# EAGLE design lights (EAGLE 5.11)
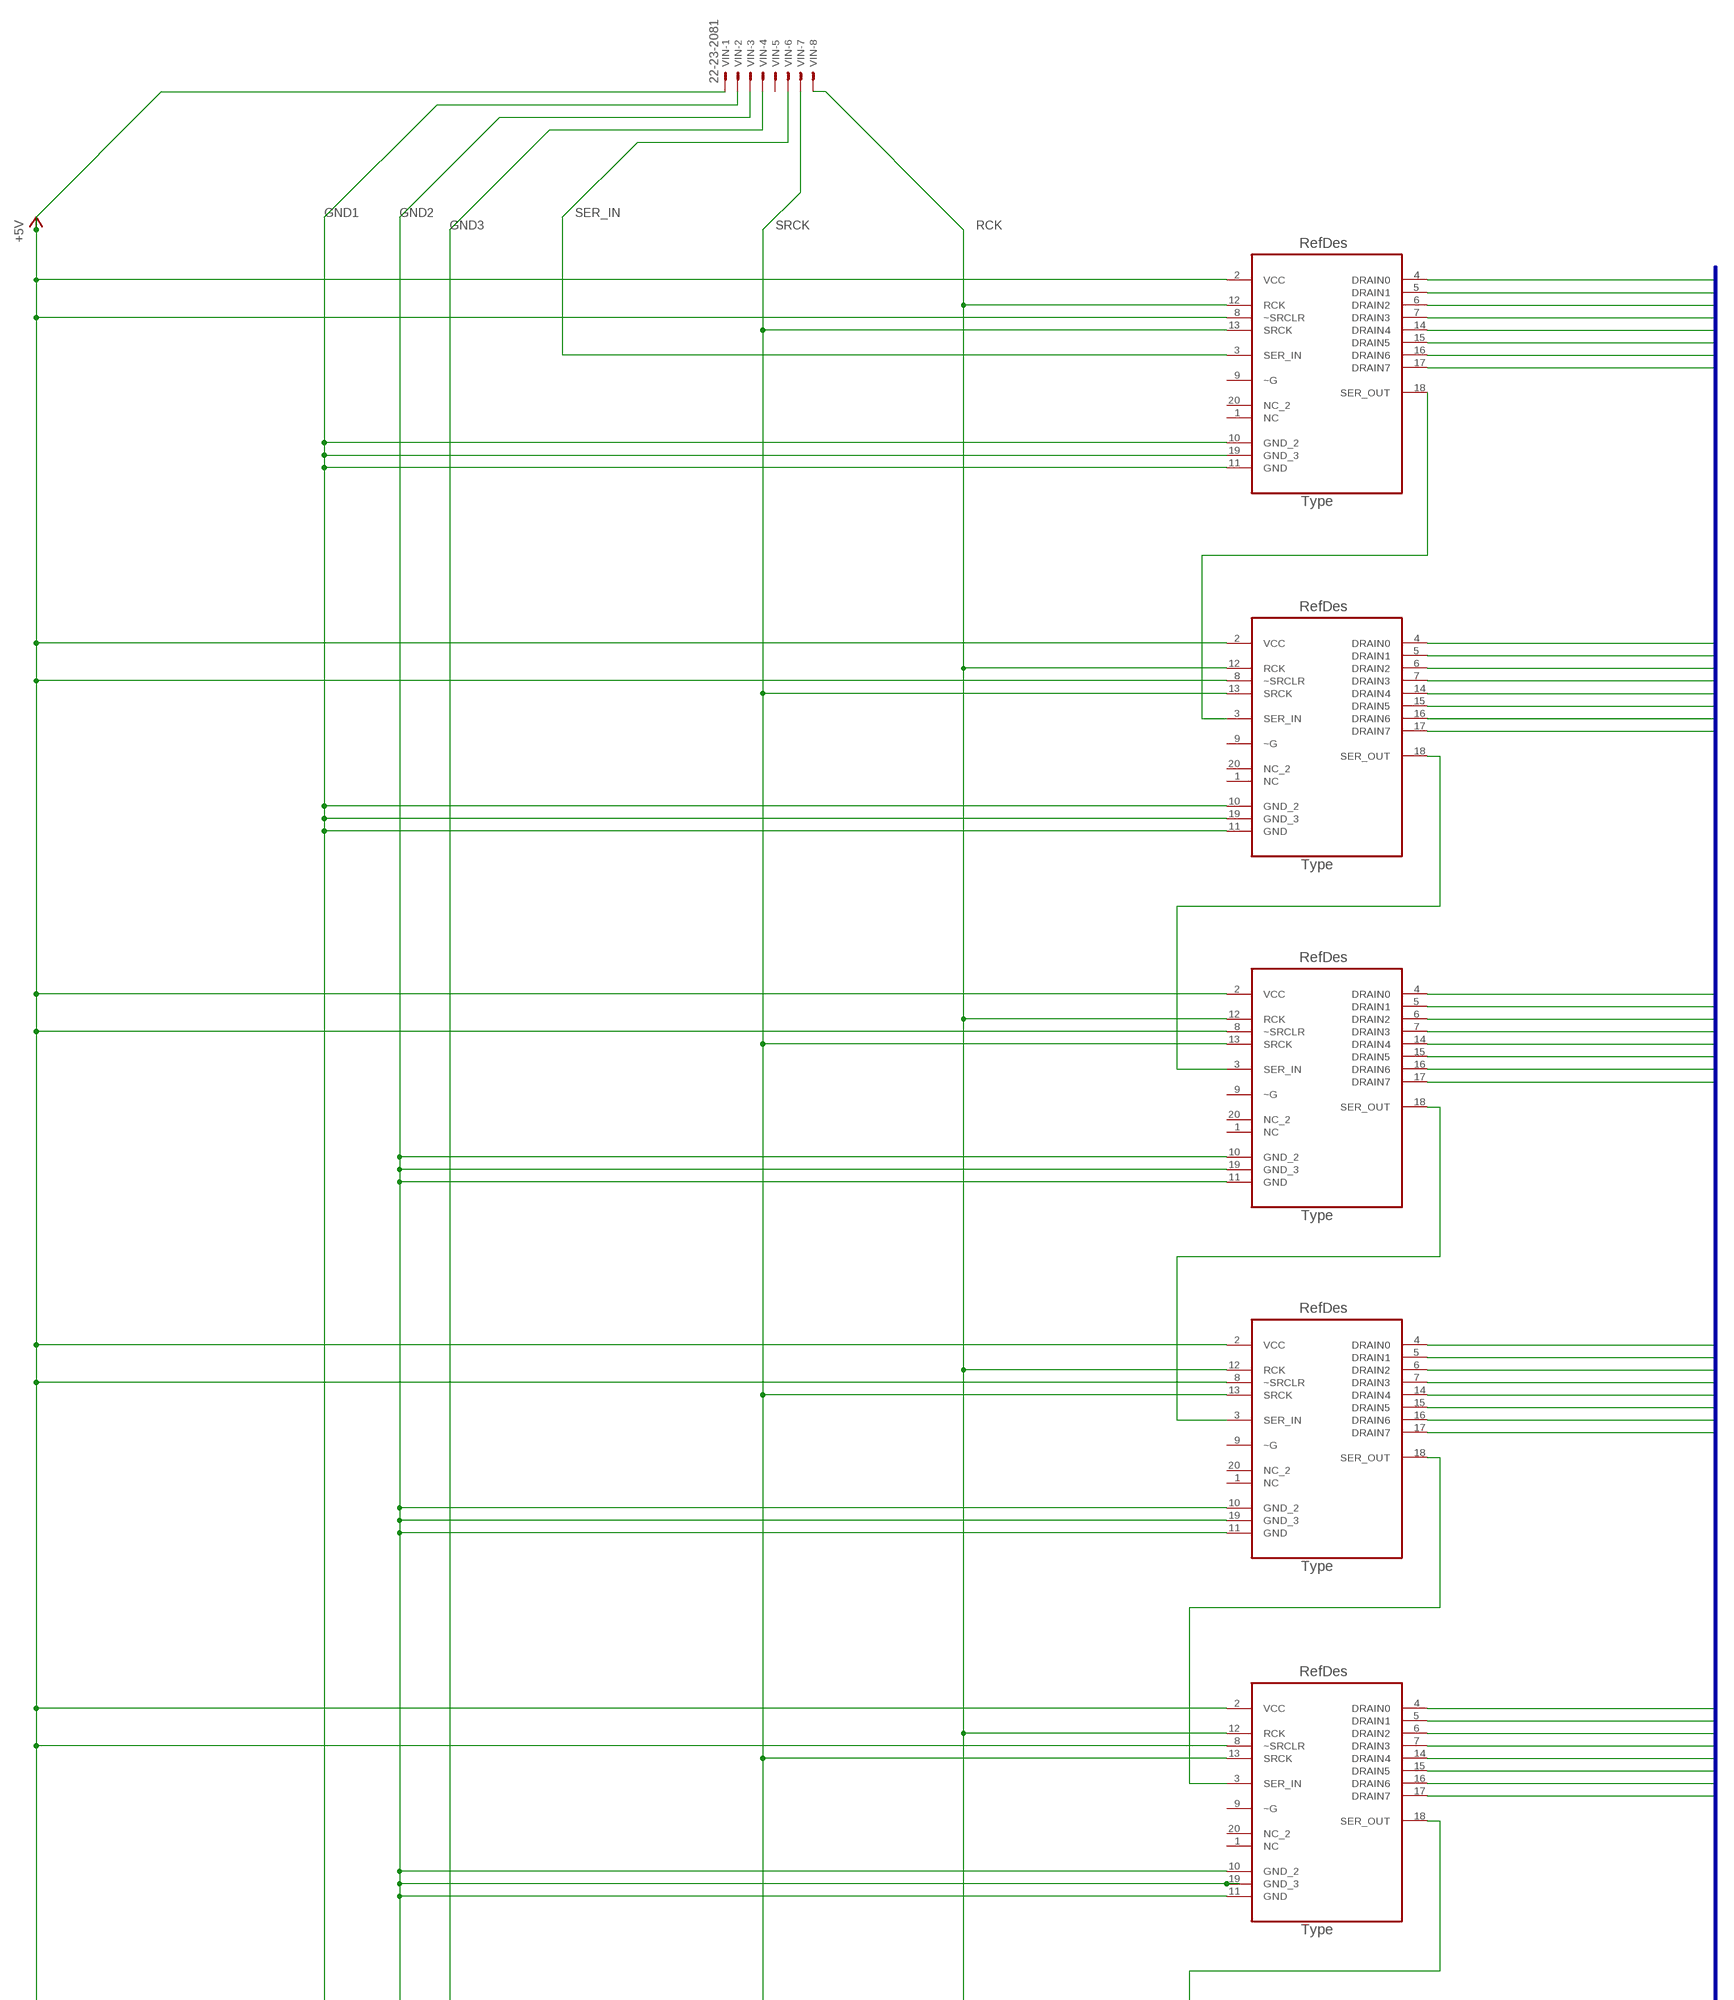
[diagram p0: schematic, sheet 1, part 1 of 3]
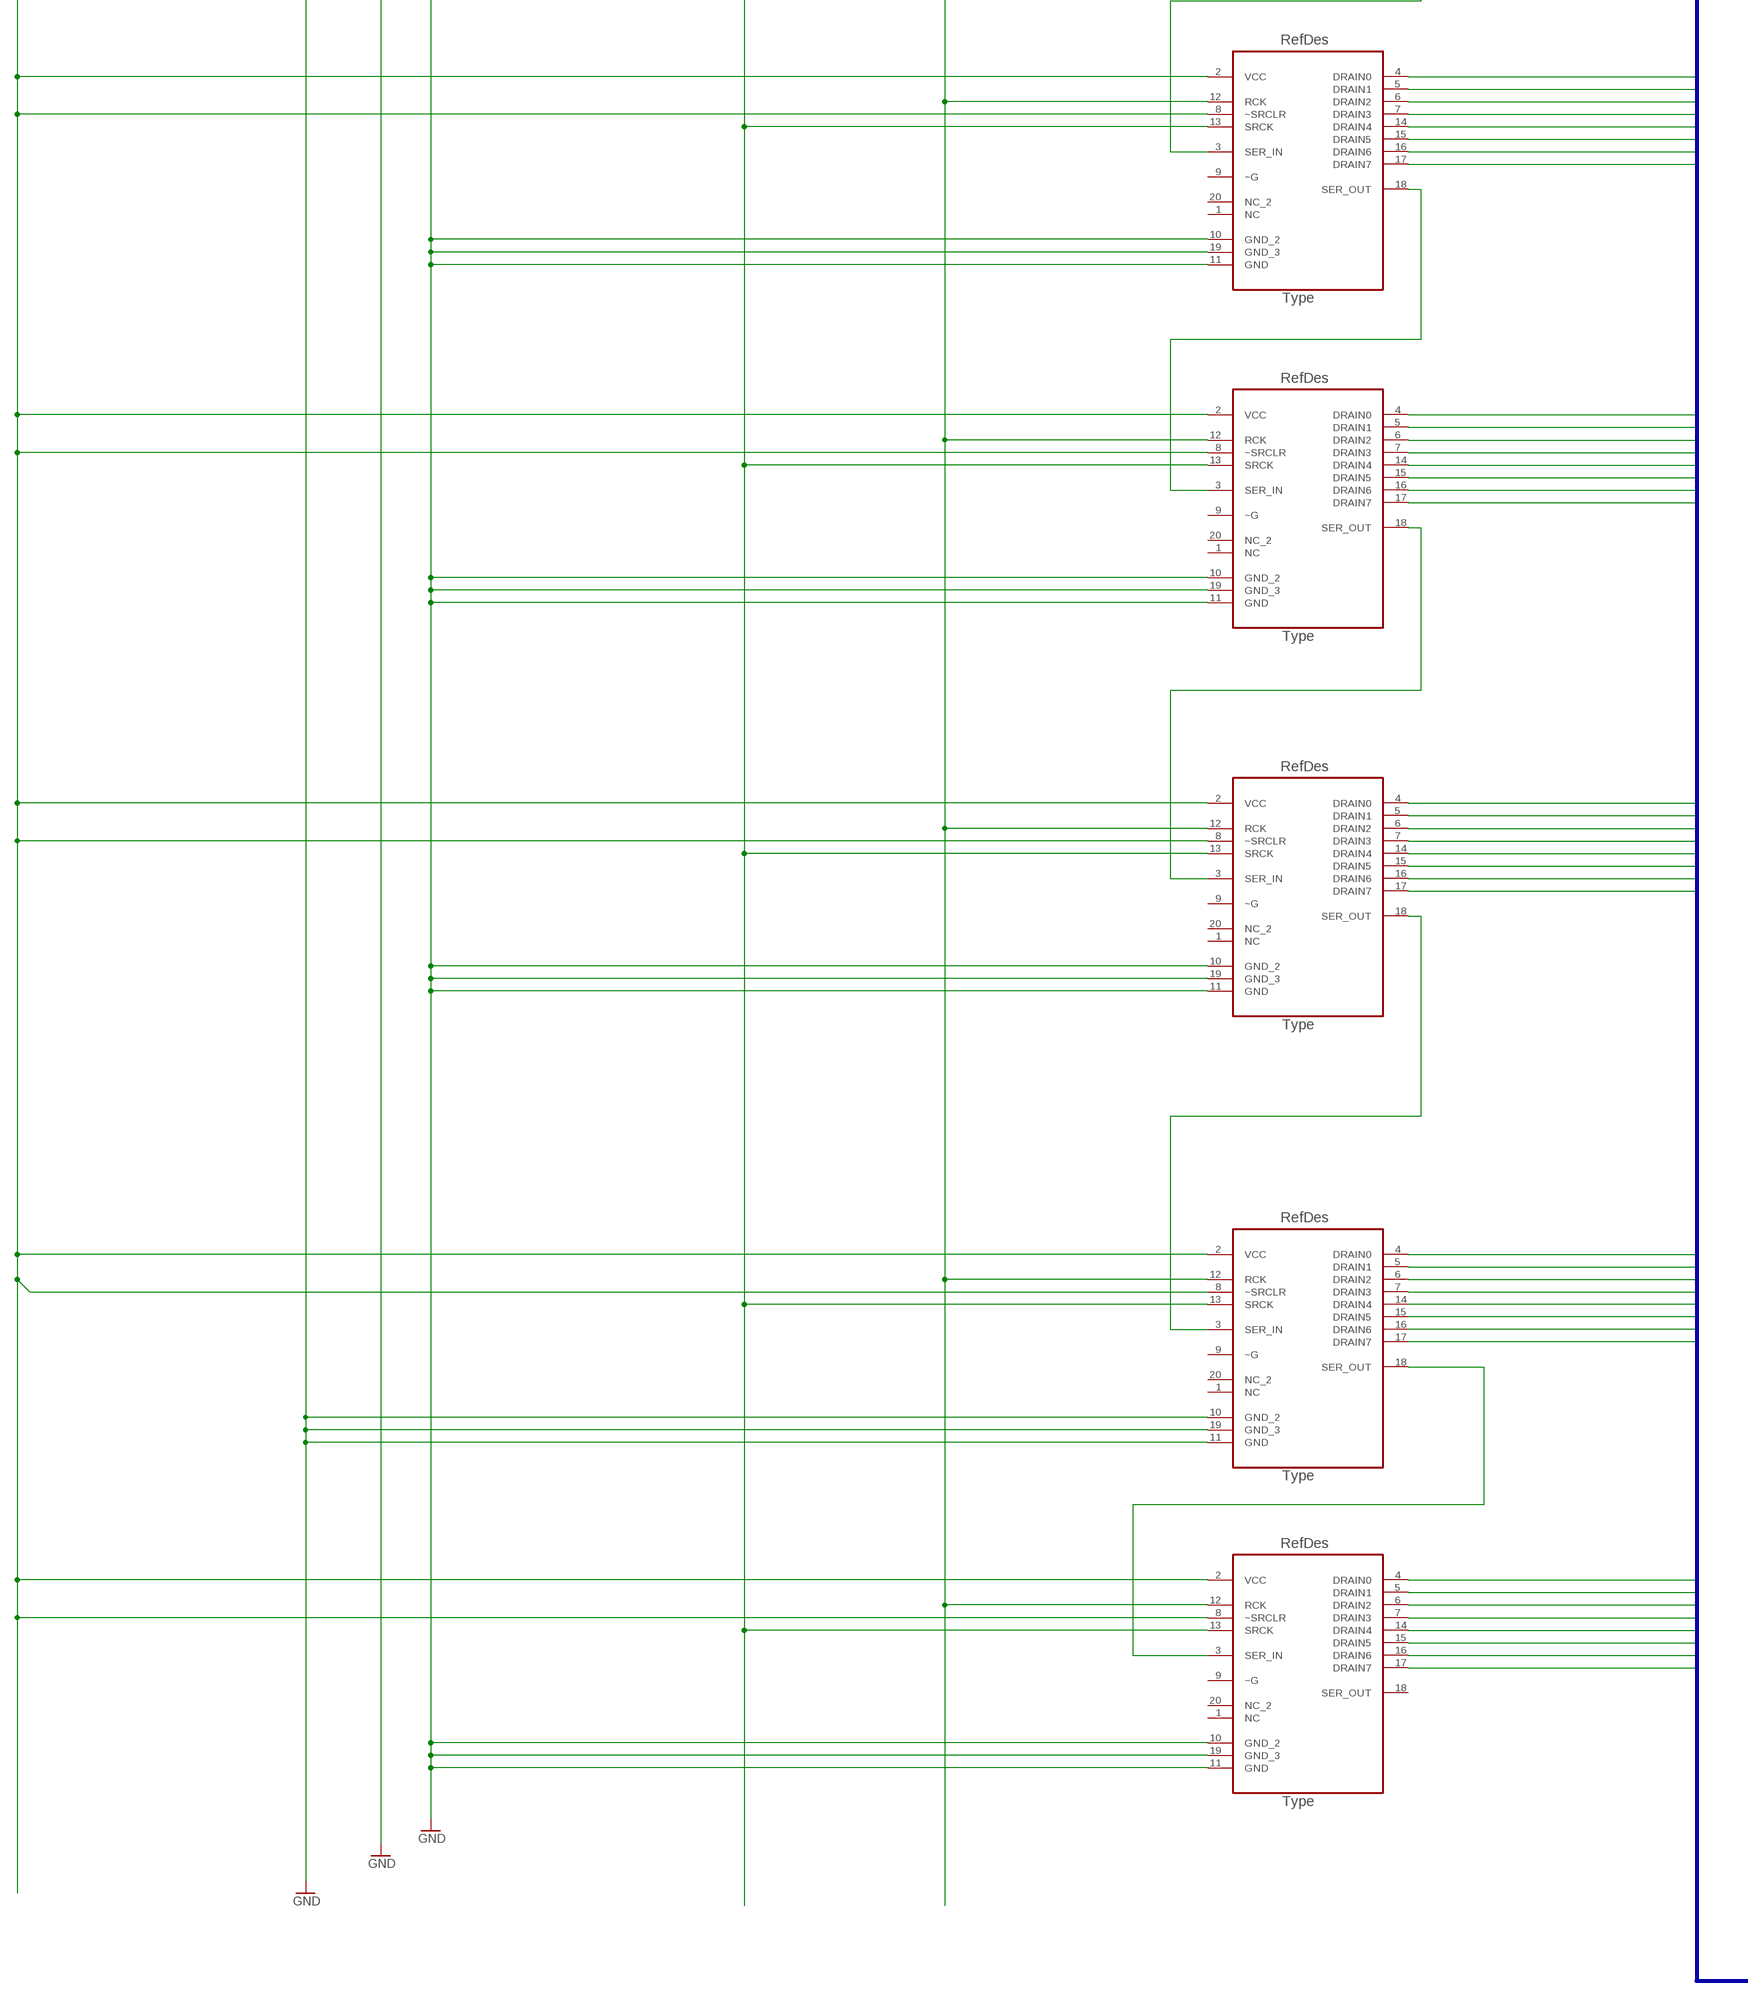
[diagram p1: schematic, sheet 1, part 2 of 3]
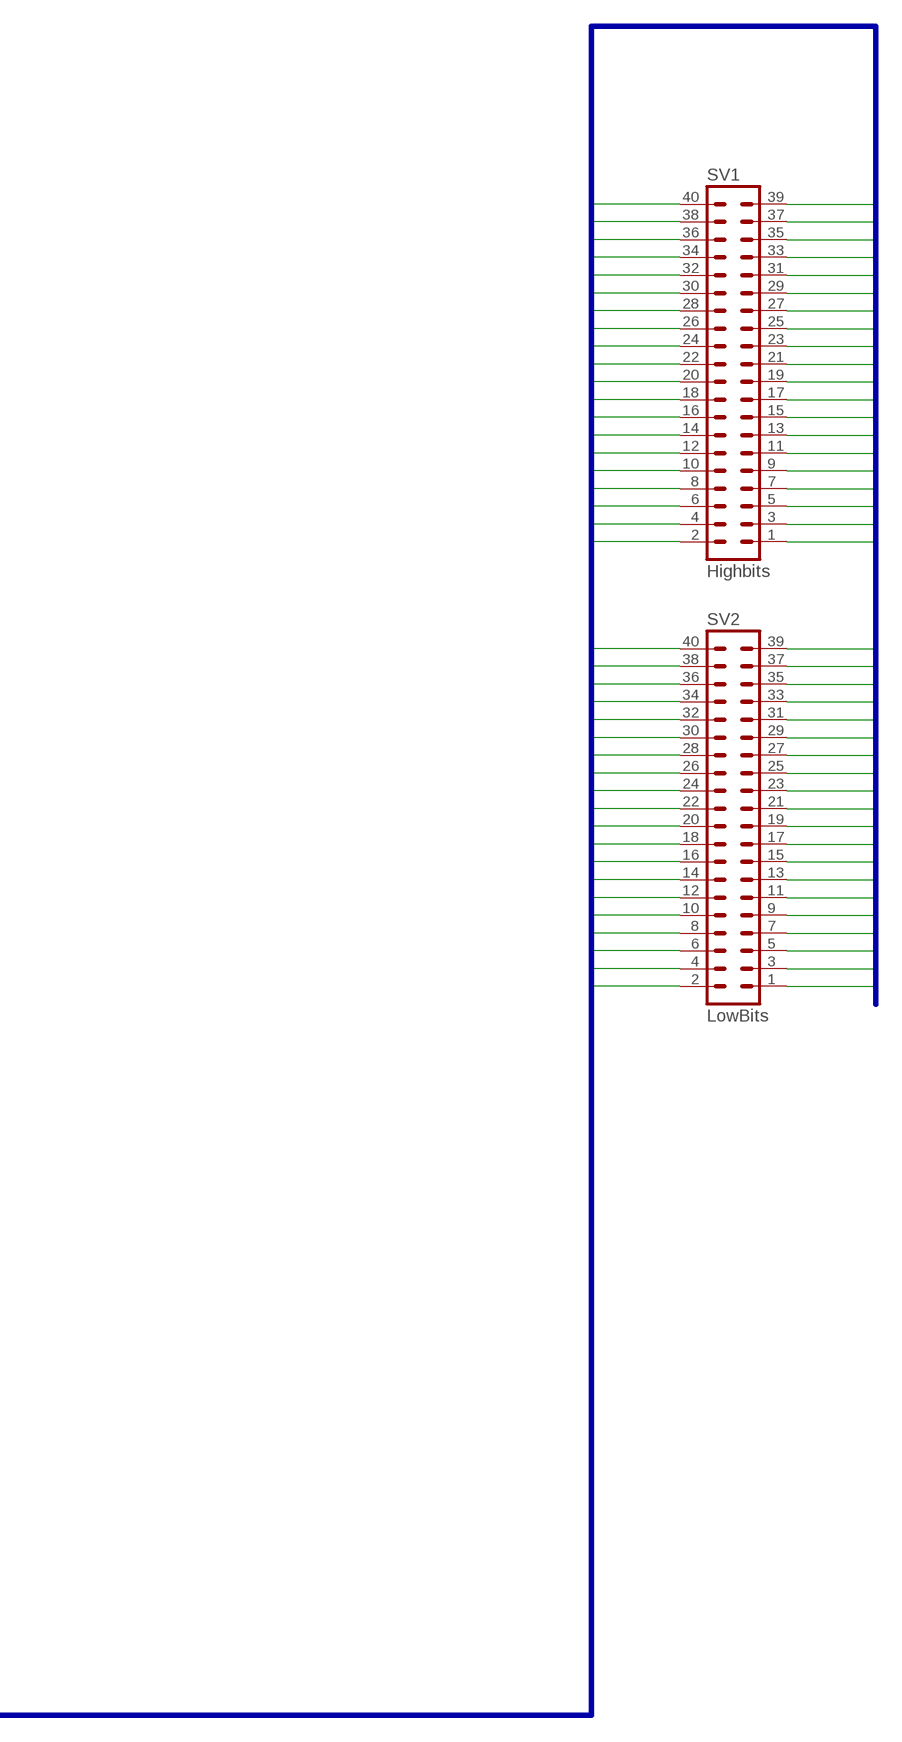
[diagram p2: schematic, sheet 1, part 3 of 3]

## Parts
SR1  TPIC6B595N  [DIP254P762X508-20]
SR2  TPIC6B595N  [DIP254P762X508-20]
SR3  TPIC6B595N  [DIP254P762X508-20]
SR4  TPIC6B595N  [DIP254P762X508-20]
SR5  TPIC6B595N  [DIP254P762X508-20]
SR6  TPIC6B595N  [DIP254P762X508-20]
SR7  TPIC6B595N  [DIP254P762X508-20]
SR8  TPIC6B595N  [DIP254P762X508-20]
SR9  TPIC6B595N  [DIP254P762X508-20]
SR10  TPIC6B595N  [DIP254P762X508-20]
SV1  Highbits  MA20-2  [MA20-2]
SV2  LowBits  MA20-2  [MA20-2]
VIN  22-23-2081  [22-23-2081]

## Nets
+5V: SR1.2(VCC) SR1.8(~SRCLR) SR2.2(VCC) SR2.8(~SRCLR) SR3.2(VCC) SR3.8(~SRCLR) SR4.2(VCC) SR4.8(~SRCLR) SR5.2(VCC) SR5.8(~SRCLR) SR6.2(VCC) SR6.8(~SRCLR) SR7.2(VCC) SR7.8(~SRCLR) SR8.2(VCC) SR8.8(~SRCLR) SR9.2(VCC) SR9.8(~SRCLR) SR10.2(VCC) SR10.8(~SRCLR) VIN.1
GND1: SR1.10(GND_2) SR1.11(GND) SR1.19(GND_3) SR2.10(GND_2) SR2.11(GND) SR2.19(GND_3) SR9.10(GND_2) SR9.11(GND) SR9.19(GND_3) VIN.2 ; supply symbol labelled GND
GND2: SR3.10(GND_2) SR3.11(GND) SR3.19(GND_3) SR4.10(GND_2) SR4.11(GND) SR4.19(GND_3) SR5.10(GND_2) SR5.11(GND) SR5.19(GND_3) VIN.3 ; supply symbol labelled GND
GND3: SR6.10(GND_2) SR6.11(GND) SR6.19(GND_3) SR7.10(GND_2) SR7.11(GND) SR7.19(GND_3) SR8.10(GND_2) SR8.11(GND) SR8.19(GND_3) SR10.10(GND_2) SR10.11(GND) SR10.19(GND_3) VIN.4 ; supply symbol labelled GND
LIGHTBIT1: SR10.17(DRAIN7) SV2.1
LIGHTBIT2: SR10.16(DRAIN6) SV2.2
LIGHTBIT3: SR10.15(DRAIN5) SV2.3
LIGHTBIT4: SR10.14(DRAIN4) SV2.4
LIGHTBIT5: SR10.7(DRAIN3) SV2.5
LIGHTBIT6: SR10.6(DRAIN2) SV2.6
LIGHTBIT7: SR10.5(DRAIN1) SV2.7
LIGHTBIT8: SR10.4(DRAIN0) SV2.8
LIGHTBIT9: SR9.17(DRAIN7) SV2.9
LIGHTBIT10: SR9.16(DRAIN6) SV2.10
LIGHTBIT11: SR9.15(DRAIN5) SV2.11
LIGHTBIT12: SR9.14(DRAIN4) SV2.12
LIGHTBIT13: SR9.7(DRAIN3) SV2.13
LIGHTBIT14: SR9.6(DRAIN2) SV2.14
LIGHTBIT15: SR9.5(DRAIN1) SV2.15
LIGHTBIT16: SR9.4(DRAIN0) SV2.16
LIGHTBIT17: SR8.17(DRAIN7) SV2.17
LIGHTBIT18: SR8.16(DRAIN6) SV2.18
LIGHTBIT19: SR8.15(DRAIN5) SV2.19
LIGHTBIT20: SR8.14(DRAIN4) SV2.20
LIGHTBIT21: SR8.7(DRAIN3) SV2.21
LIGHTBIT22: SR8.6(DRAIN2) SV2.22
LIGHTBIT23: SR8.5(DRAIN1) SV2.23
LIGHTBIT24: SR8.4(DRAIN0) SV2.24
LIGHTBIT25: SR7.17(DRAIN7) SV2.25
LIGHTBIT26: SR7.16(DRAIN6) SV2.26
LIGHTBIT27: SR7.15(DRAIN5) SV2.27
LIGHTBIT28: SR7.14(DRAIN4) SV2.28
LIGHTBIT29: SR7.7(DRAIN3) SV2.29
LIGHTBIT30: SR7.6(DRAIN2) SV2.30
LIGHTBIT31: SR7.5(DRAIN1) SV2.31
LIGHTBIT32: SR7.4(DRAIN0) SV2.32
LIGHTBIT33: SR6.17(DRAIN7) SV2.33
LIGHTBIT34: SR6.16(DRAIN6) SV2.34
LIGHTBIT35: SR6.15(DRAIN5) SV2.35
LIGHTBIT36: SR6.14(DRAIN4) SV2.36
LIGHTBIT37: SR6.7(DRAIN3) SV2.37
LIGHTBIT38: SR6.6(DRAIN2) SV2.38
LIGHTBIT39: SR6.5(DRAIN1) SV2.39
LIGHTBIT40: SR6.4(DRAIN0) SV2.40
LIGHTBIT41: SR5.17(DRAIN7) SV1.1
LIGHTBIT42: SR5.16(DRAIN6) SV1.2
LIGHTBIT43: SR5.15(DRAIN5) SV1.3
LIGHTBIT44: SR5.14(DRAIN4) SV1.4
LIGHTBIT45: SR5.7(DRAIN3) SV1.5
LIGHTBIT46: SR5.6(DRAIN2) SV1.6
LIGHTBIT47: SR5.5(DRAIN1) SV1.7
LIGHTBIT48: SR5.4(DRAIN0) SV1.8
LIGHTBIT49: SR4.17(DRAIN7) SV1.9
LIGHTBIT50: SR4.16(DRAIN6) SV1.10
LIGHTBIT51: SR4.15(DRAIN5) SV1.11
LIGHTBIT52: SR4.14(DRAIN4) SV1.12
LIGHTBIT53: SR4.7(DRAIN3) SV1.13
LIGHTBIT54: SR4.6(DRAIN2) SV1.14
LIGHTBIT55: SR4.5(DRAIN1) SV1.15
LIGHTBIT56: SR4.4(DRAIN0) SV1.16
LIGHTBIT57: SR3.17(DRAIN7) SV1.17
LIGHTBIT58: SR3.16(DRAIN6) SV1.18
LIGHTBIT59: SR3.15(DRAIN5) SV1.19
LIGHTBIT60: SR3.14(DRAIN4) SV1.20
LIGHTBIT61: SR3.7(DRAIN3) SV1.21
LIGHTBIT62: SR3.6(DRAIN2) SV1.22
LIGHTBIT63: SR3.5(DRAIN1) SV1.23
LIGHTBIT64: SR3.4(DRAIN0) SV1.24
LIGHTBIT65: SR2.17(DRAIN7) SV1.25
LIGHTBIT66: SR2.16(DRAIN6) SV1.26
LIGHTBIT67: SR2.15(DRAIN5) SV1.27
LIGHTBIT68: SR2.14(DRAIN4) SV1.28
LIGHTBIT69: SR2.7(DRAIN3) SV1.29
LIGHTBIT70: SR2.6(DRAIN2) SV1.30
LIGHTBIT71: SR2.5(DRAIN1) SV1.31
LIGHTBIT72: SR2.4(DRAIN0) SV1.32
LIGHTBIT73: SR1.17(DRAIN7) SV1.33
LIGHTBIT74: SR1.16(DRAIN6) SV1.34
LIGHTBIT75: SR1.15(DRAIN5) SV1.35
LIGHTBIT76: SR1.14(DRAIN4) SV1.36
LIGHTBIT77: SR1.7(DRAIN3) SV1.37
LIGHTBIT78: SR1.6(DRAIN2) SV1.38
LIGHTBIT79: SR1.5(DRAIN1) SV1.39
LIGHTBIT80: SR1.4(DRAIN0) SV1.40
N$4: SR9.18(SER_OUT) SR10.3(SER_IN)
N$9: SR1.18(SER_OUT) SR2.3(SER_IN)
N$18: SR2.18(SER_OUT) SR3.3(SER_IN)
N$27: SR3.18(SER_OUT) SR4.3(SER_IN)
N$36: SR4.18(SER_OUT) SR5.3(SER_IN)
N$45: SR5.18(SER_OUT) SR6.3(SER_IN)
N$62: SR7.18(SER_OUT) SR8.3(SER_IN)
N$71: SR8.18(SER_OUT) SR9.3(SER_IN)
N$80: SR6.18(SER_OUT) SR7.3(SER_IN)
RCK: SR1.12(RCK) SR2.12(RCK) SR3.12(RCK) SR4.12(RCK) SR5.12(RCK) SR6.12(RCK) SR7.12(RCK) SR8.12(RCK) SR9.12(RCK) SR10.12(RCK) VIN.8
SER_IN: SR1.3(SER_IN) VIN.6
SRCK: SR1.13(SRCK) SR2.13(SRCK) SR3.13(SRCK) SR4.13(SRCK) SR5.13(SRCK) SR6.13(SRCK) SR7.13(SRCK) SR8.13(SRCK) SR9.13(SRCK) SR10.13(SRCK) VIN.7
Unconnected: SR1.1(NC) SR1.9(~G) SR1.20(NC_2) SR2.1(NC) SR2.9(~G) SR2.20(NC_2) SR3.1(NC) SR3.9(~G) SR3.20(NC_2) SR4.1(NC) SR4.9(~G) SR4.20(NC_2) SR5.1(NC) SR5.9(~G) SR5.20(NC_2) SR6.1(NC) SR6.9(~G) SR6.20(NC_2) SR7.1(NC) SR7.9(~G) SR7.20(NC_2) SR8.1(NC) SR8.9(~G) SR8.20(NC_2) SR9.1(NC) SR9.9(~G) SR9.20(NC_2) SR10.1(NC) SR10.9(~G) SR10.18(SER_OUT) SR10.20(NC_2) VIN.5

## Buses
LIGHTBIT[1..80]

## Library data of the parts
SR1-SR10 = tpic68595N:TPIC6B595N: POWER LOGIC 8-BIT SHIFT REGISTER; DESCRIPTION: POWER LOGIC 8-BIT SHIFT REGISTER; MPN: TPIC6B595N; OC_FARNELL: 1287675; OC_NEWARK: 15M1973; PACKAGE: PDIP-20; SUPPLIER: Texas Instruments
SV1 SV2 = con-lstb:MA20-2: PIN HEADER; OC_FARNELL: unknown; OC_NEWARK: unknown
VIN = con-molex:22-23-2081: .100" (2.54mm) Center Header - 8 Pin; MF: MOLEX; MPN: 22-23-2081; OC_FARNELL: 1756826; OC_NEWARK: 01C7592

## Board
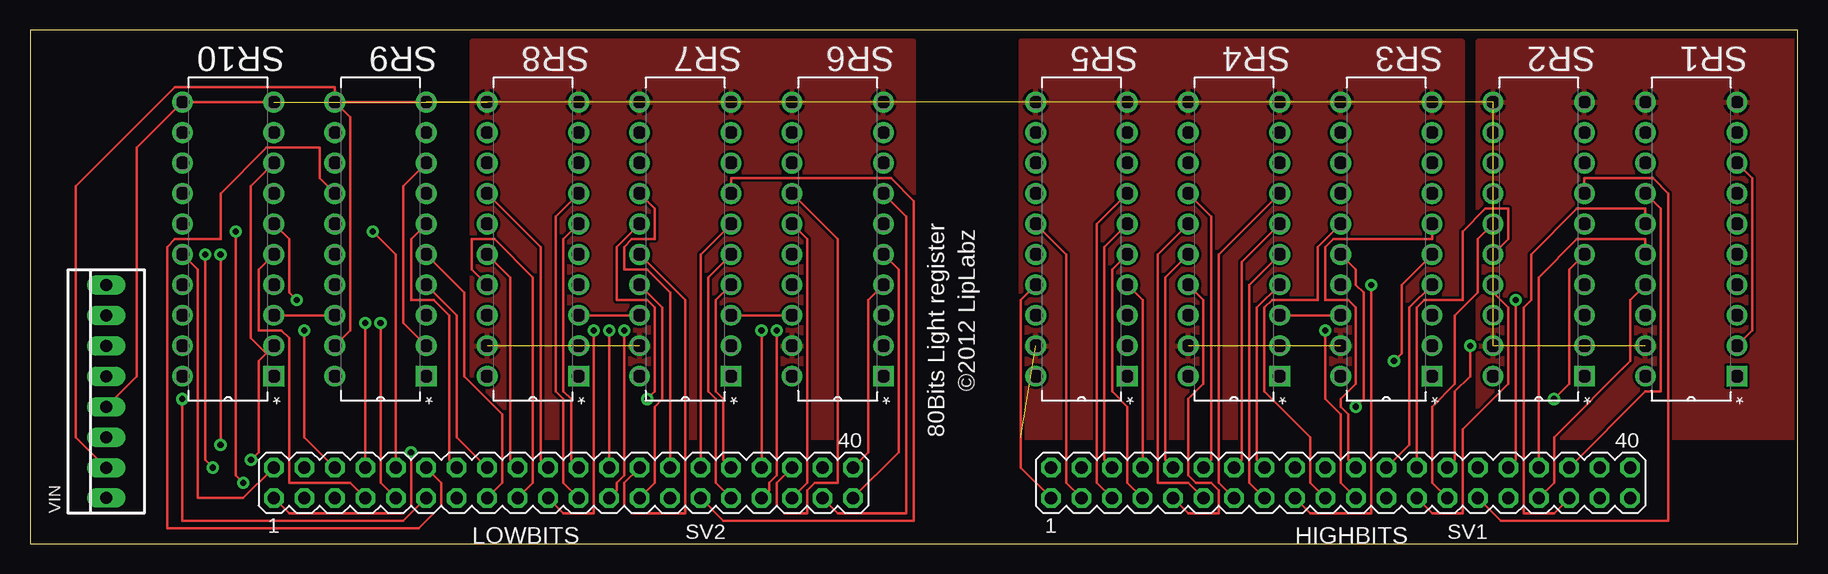
[diagram p3: board, top side]
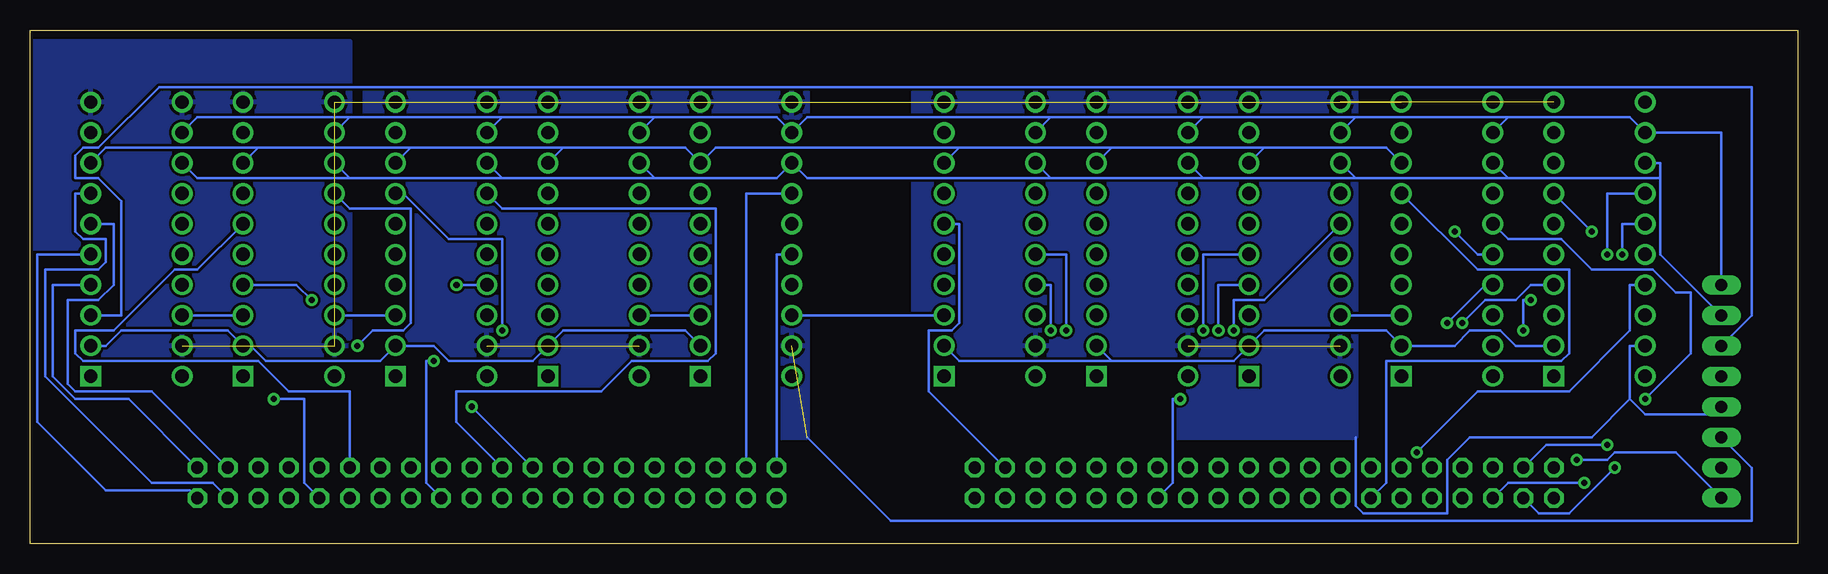
[diagram p4: board, bottom side, seen from below]

Size 147.3 x 42.85 mm. Coordinates in mm from the lower left corner, seen from the top.
Outline: 0,0 147.3,0 147.3,42.85 0,42.85 0,0
Copper layers (1*16): Top 0.035mm / dielectric 1.5mm / Bottom 0.035mm
Design rules "SparkFun": minimum track width 8mil, minimum drill 20mil, track to track 8mil, track to pad 8mil, pad to pad 8mil, via to via 8mil, smd to smd 8mil, copper to edge 10mil, drill to drill 8mil, minimum pad ring 12mil, minimum via ring 10mil, stop-mask expansion 4mil, vias tented up to drill 25mil, thermal gap 10mil

### Footprints (pad centres in the part's own frame; a part is rotated, then mirrored left to right if it is on the bottom)
DIP254P762X508-20 = drill 1.118 square: 1 -7.62,22.86 | drill 1.118 round: 2 -7.62,20.32; 3 -7.62,17.78; 4 -7.62,15.24; 5 -7.62,12.7; 6 -7.62,10.16; 7 -7.62,7.62; 8 -7.62,5.08; 9 -7.62,2.54; 10 -7.62,0; 11 0,0; 12 0,2.54; 13 0,5.08; 14 0,7.62; 15 0,10.16; 16 0,12.7; 17 0,15.24; 18 0,17.78; 19 0,20.32; 20 0,22.86
MA20-2 = drill 1.016 octagon: 1 -24.13,-1.27; 2 -24.13,1.27; 3 -21.59,-1.27; 4 -21.59,1.27; 5 -19.05,-1.27; 6 -19.05,1.27; 7 -16.51,-1.27; 8 -16.51,1.27; 9 -13.97,-1.27; 10 -13.97,1.27; 11 -11.43,-1.27; 12 -11.43,1.27; 13 -8.89,-1.27; 14 -8.89,1.27; 15 -6.35,-1.27; 16 -6.35,1.27; 17 -3.81,-1.27; 18 -3.81,1.27; 19 -1.27,-1.27; 20 -1.27,1.27; 21 1.27,-1.27; 22 1.27,1.27; 23 3.81,-1.27; 24 3.81,1.27; 25 6.35,-1.27; 26 6.35,1.27; 27 8.89,-1.27; 28 8.89,1.27; 29 11.43,-1.27; 30 11.43,1.27; 31 13.97,-1.27; 32 13.97,1.27; 33 16.51,-1.27; 34 16.51,1.27; 35 19.05,-1.27; 36 19.05,1.27; 37 21.59,-1.27; 38 21.59,1.27; 39 24.13,-1.27; 40 24.13,1.27
22-23-2081 = drill 1 long: 1 -8.89,0; 2 -6.35,0; 3 -3.81,0; 4 -1.27,0; 5 1.27,0; 6 3.81,0; 7 6.35,0; 8 8.89,0

### Placement (x,y rotation side)
SR1  134.62,36.83 180 top
SR2  121.92,36.83 180 top
SR3  109.22,36.83 180 top
SR4  96.52,36.83 180 top
SR5  83.82,36.83 180 top
SR6  63.5,36.83 180 top
SR7  50.8,36.83 180 top
SR8  38.1,36.83 180 top
SR9  25.4,36.83 180 top
SR10  12.7,36.83 180 top
SV1  109.22,5.08 0 top
SV2  44.45,5.08 0 top
VIN  6.35,12.7 90 top

### Tracks (layer width: path | path; a pad name or v marks a point on that pad's centre or on a via)
+5V  (via drill 0.51)
  Top 0.203: SR1.2 143.51,17.78 143.51,30.48 SR1.8 | v18.41,6.99 19.05,7.62 19.05,15.24 19.68,15.88 | 19.68,15.88 SR10.2 | SR10.8 18.41,29.84 18.41,17.14 19.68,15.88 | SR9.2 31.11,18.41 31.11,29.84 SR9.8
  Bottom 0.203: SR5.2 92.71,17.78 102.87,17.78 SR4.2 105.41,15.24 112.39,15.24 113.67,16.51 SR3.2 118.11,15.24 127.64,15.24 128.91,16.51 SR2.2 130.81,17.78 139.7,17.78 140.97,16.51 SR1.2 | 102.87,33.02 92.71,33.02 SR5.8 90.17,33.02 69.85,33.02 | 102.87,33.02 SR4.8 | 115.57,33.02 SR3.8 | 102.87,33.02 115.57,33.02 | 128.27,33.02 SR2.8 | 115.57,33.02 128.27,33.02 | SR1.8 140.97,33.02 128.27,33.02 | VIN.1 10.16,7.62 15.24,7.62 15.88,6.99 v18.41,6.99 | 57.15,15.24 SR7.2 | 57.15,15.24 46.99,15.24 SR8.2 44.45,17.78 34.29,17.78 SR9.2 28.57,16.51 27.3,17.78 24.77,17.78 23.5,16.51 SR10.2 | SR6.2 69.85,15.24 57.15,15.24 | SR9.8 34.29,33.02 44.45,33.02 | 44.45,33.02 SR8.8 | 57.15,33.02 SR7.8 | 44.45,33.02 57.15,33.02 | 69.85,33.02 SR6.8 | 57.15,33.02 69.85,33.02
GND1  (3 unrouted)
  Top 0.203: VIN.2 3.81,8.89 3.81,29.84 12.06,38.1 25.4,38.1 SR9.11 | SR9.19 26.67,17.78 26.67,35.56 SR9.11 | SR9.11 SR9.10
  pour Bottom: 147.32,41.91 120.65,41.91 120.65,8.89 146.05,8.89 147.32,8.89
  pour Top: 147.32,8.89 147.32,41.91 120.65,41.91 120.65,8.89
  pour Bottom: 120.65,41.91 120.65,8.89 147.32,8.89 147.32,41.91
GND2  (2 unrouted)
  Bottom 0.203: VIN.3 3.81,6.35 3.81,1.91 75.56,1.91 82.55,8.89
  pour Bottom: 119.38,8.89 119.38,41.91 82.55,41.91 82.55,8.89
  pour Top: 119.38,8.89 119.38,41.91 82.55,41.91 82.55,8.89
  pour Bottom: 119.38,41.91 119.38,8.89 82.55,8.89 82.55,41.91
GND3  (2 unrouted)
  Top 0.203: SR10.10 SR10.11 8.89,33.02 8.89,13.97 VIN.4
  Bottom 0.203: VIN.4 6.99,10.79 12.7,10.79 13.97,12.06 | 13.97,12.06 13.97,16.51 SR10.19 | 13.97,12.06 17.14,8.89 27.3,8.89 29.21,6.99 29.21,2.54 36.2,2.54 36.83,3.17 36.83,8.89
  pour Bottom: 73.66,8.89 73.66,41.91 36.83,41.91 36.83,8.89
  pour Top: 73.66,8.89 73.66,41.91 36.83,41.91 36.83,8.89
  pour Bottom: 73.66,41.91 73.66,8.89 36.83,8.89 36.83,41.91
LIGHTBIT1  (via drill 0.51)
  Top 0.203: SV2.1 21.59,2.54 31.11,2.54 31.75,3.17 v31.75,7.62
  Bottom 0.203: v31.75,7.62 26.67,12.7 19.05,12.7 13.97,17.78 13.97,21.59 SR10.17
LIGHTBIT2
  Top 0.203: SV2.2 17.78,3.81 13.97,3.81 13.97,22.86 SR10.16
LIGHTBIT3  (via drill 0.51)
  Top 0.203: v15.24,6.35 14.61,6.99 v14.61,24.13
  Bottom 0.203: SV2.3 21.59,2.54 19.05,2.54 v15.24,6.35 | v14.61,24.13 14.61,26.67 SR10.15
LIGHTBIT4  (via drill 0.51)
  Top 0.203: v15.88,8.26 v15.88,24.13
  Bottom 0.203: SV2.4 20.95,8.26 v15.88,8.26 | v15.88,24.13 15.88,29.21 SR10.14
LIGHTBIT5  (via drill 0.51)
  Top 0.203: v17.78,5.08 17.14,5.71 v17.14,26.04
  Bottom 0.203: SV2.5 24.13,5.08 v17.78,5.08 | v17.14,26.04 SR10.7
LIGHTBIT6  (via drill 0.51)
  Top 0.203: SV2.6 22.86,8.89 v22.86,17.78 | v22.23,20.32 21.59,20.95 21.59,25.4 SR10.6
  Bottom 0.203: v22.86,17.78 22.86,20.32 v22.23,20.32
LIGHTBIT7
  Top 0.203: SV2.7 26.67,5.08 21.59,5.08 21.59,17.14 20.95,17.78 19.05,17.78 19.05,22.86 SR10.5
LIGHTBIT8  (via drill 0.51)
  Top 0.203: SV2.8 v27.94,18.41
  Bottom 0.203: v27.94,18.41 26.04,20.32 23.5,20.32 22.23,21.59 SR10.4
LIGHTBIT9  (via drill 0.51)
  Top 0.203: SV2.9 29.21,5.08 v29.21,18.41
  Bottom 0.203: v29.21,18.41 26.04,21.59 SR9.17
LIGHTBIT10  (via drill 0.51)
  Top 0.203: SV2.10 30.48,24.13 v28.57,26.04
  Bottom 0.203: v28.57,26.04 26.67,24.13 SR9.16
LIGHTBIT11  (via drill 0.51)
  Top 0.203: SV2.11 31.11,1.91 12.7,1.91 v12.7,12.06
  Bottom 0.203: v12.7,12.06 8.89,15.88 8.89,20.95 10.16,20.95 12.06,22.86 17.14,22.86 19.68,25.4 24.13,25.4 SR9.15
LIGHTBIT12
  Top 0.203: SV2.12 34.29,5.08 34.29,3.17 32.38,1.27 11.43,1.27 11.43,24.77 12.06,25.4 15.88,25.4 15.88,29.21 19.68,33.02 24.13,33.02 24.13,30.48 SR9.14
LIGHTBIT13
  Bottom 0.203: SV2.13 34.29,5.08 34.29,15.24 19.68,15.24 19.05,15.88 19.05,22.86 26.67,22.86 SR9.7
LIGHTBIT14
  Top 0.203: SV2.14 34.92,6.99 34.92,19.05 33.66,20.32 31.75,20.32 31.75,25.4 SR9.6
LIGHTBIT15
  Top 0.203: SV2.15 39.37,5.08 39.37,10.79 36.2,13.97 36.2,20.95 SR9.5
LIGHTBIT16
  Top 0.203: SV2.16 35.56,8.89 35.56,19.05 SR9.4
LIGHTBIT17
  Top 0.203: SV2.17 41.91,5.08 41.91,22.23 38.73,25.4 36.83,25.4 36.83,22.86 SR8.17
LIGHTBIT18
  Top 0.203: SV2.18 40.01,6.99 40.01,22.23 SR8.16
LIGHTBIT19  (via drill 0.51)
  Top 0.203: SV2.19 44.45,2.54 46.99,2.54 v46.99,17.78
  Bottom 0.203: v46.99,17.78 46.99,20.32 44.45,20.32 SR8.15
LIGHTBIT20
  Top 0.203: SV2.20 42.55,6.99 42.55,24.77 SR8.14
LIGHTBIT21
  Top 0.203: SV2.21 44.45,5.08 44.45,12.06 43.81,12.7 43.81,27.3 SR8.7
LIGHTBIT22
  Top 0.203: SV2.22 45.09,6.99 45.09,12.06 44.45,12.7 44.45,25.4 SR8.6
LIGHTBIT23  (via drill 0.51)
  Top 0.203: SV2.23 48.9,4.45 48.9,5.08 49.53,5.71 v49.53,17.78
  Bottom 0.203: v49.53,17.78 49.53,24.13 SR8.5
LIGHTBIT24  (via drill 0.51)
  Top 0.203: SV2.24 v48.26,17.78
  Bottom 0.203: v48.26,17.78 48.26,21.59 SR8.4
LIGHTBIT25
  Top 0.203: SV2.25 52.07,5.08 52.07,11.43 52.7,12.06 52.7,19.68 SR7.17
LIGHTBIT26
  Top 0.203: SV2.26 49.53,5.08 49.53,3.17 50.16,2.54 54.61,2.54 54.61,20.32 SR7.16
LIGHTBIT27  (via drill 0.51)
  Top 0.203: v51.44,12.06 52.07,12.7 52.07,19.68 51.44,20.32 48.9,20.32 48.9,24.77 SR7.15
  Bottom 0.203: SV2.27 52.07,5.08 52.07,12.06 v51.44,12.06
LIGHTBIT28
  Top 0.203: SV2.28 53.34,20.95 51.44,22.86 49.53,22.86 49.53,24.77 50.16,25.4 52.07,25.4 52.07,27.94 SR7.14
LIGHTBIT29
  Top 0.203: SV2.29 57.78,1.91 73.66,1.91 73.66,28.57 71.75,30.48 58.42,30.48 SR7.7
LIGHTBIT30
  Top 0.203: SV2.30 55.88,24.13 SR7.6
LIGHTBIT31
  Top 0.203: SV2.31 57.15,5.08 57.15,12.06 56.52,12.7 56.52,22.23 SR7.5
LIGHTBIT32
  Top 0.203: SV2.32 57.78,6.99 57.78,12.06 57.15,12.7 57.15,20.32 SR7.4
LIGHTBIT33  (via drill 0.51)
  Top 0.203: SV2.33 61.59,4.45 61.59,5.08 62.23,5.71 v62.23,17.78
  Bottom 0.203: v62.23,17.78 62.23,21.59 SR6.17
LIGHTBIT34  (via drill 0.51)
  Top 0.203: SV2.34 v60.96,17.78
  Bottom 0.203: v60.96,17.78 60.96,24.13 SR6.16
LIGHTBIT35
  Top 0.203: SV2.35 64.77,5.08 64.77,25.4 SR6.15
LIGHTBIT36
  Top 0.203: SV2.36 62.23,5.08 62.23,3.17 62.87,2.54 64.77,2.54 64.77,4.45 65.41,5.08 67.31,5.08 67.31,25.4 SR6.14
LIGHTBIT37
  Top 0.203: SV2.37 67.31,2.54 73.03,2.54 73.03,27.3 SR6.7
LIGHTBIT38
  Bottom 0.203: SV2.38 72.39,12.7 72.39,17.78 70.48,17.78 69.85,18.41 69.85,26.67 SR6.6
LIGHTBIT39
  Top 0.203: SV2.39 72.39,7.62 72.39,22.86 SR6.5
LIGHTBIT40
  Top 0.203: SV2.40 69.85,7.62 69.85,20.32 SR6.4
LIGHTBIT41
  Top 0.203: SV1.1 82.55,6.35 82.55,20.32 SR5.17
LIGHTBIT42
  Bottom 0.203: SV1.2 85.09,24.13 SR5.16
LIGHTBIT43
  Top 0.203: SV1.3 86.36,5.08 86.36,24.13 SR5.15
LIGHTBIT44
  Bottom 0.203: SV1.4 87.63,29.21 SR5.14
LIGHTBIT45
  Top 0.203: SV1.5 88.9,5.08 88.9,26.67 SR5.7
LIGHTBIT46
  Top 0.203: SV1.6 89.53,6.99 89.53,24.77 SR5.6
LIGHTBIT47
  Top 0.203: SV1.7 91.44,5.08 91.44,11.43 90.17,12.7 90.17,22.86 SR5.5
LIGHTBIT48
  Top 0.203: SV1.8 92.71,20.32 SR5.4
LIGHTBIT49
  Top 0.203: SV1.9 96.52,2.54 99.06,2.54 99.06,4.45 98.42,5.08 97.16,5.08 96.52,5.71 96.52,12.06 97.79,13.34 97.79,20.32 SR4.17
LIGHTBIT50
  Top 0.203: SV1.10 94.61,6.99 94.61,22.23 SR4.16
LIGHTBIT51
  Top 0.203: SV1.11 96.52,5.08 93.98,5.08 93.98,24.13 SR4.15
LIGHTBIT52
  Top 0.203: SV1.12 98.42,6.99 98.42,27.3 SR4.14
LIGHTBIT53
  Top 0.203: SV1.13 99.06,5.08 99.06,24.13 SR4.7
LIGHTBIT54
  Top 0.203: SV1.14 100.97,6.99 100.97,23.5 SR4.6
LIGHTBIT55
  Top 0.203: SV1.15 101.6,5.08 101.6,21.59 SR4.5
LIGHTBIT56
  Top 0.203: SV1.16 102.23,6.99 102.23,19.68 SR4.4
LIGHTBIT57  (via drill 0.51)
  Top 0.203: SV1.17 106.68,2.54 111.76,2.54 v111.76,21.59
  Bottom 0.203: v111.76,21.59 SR3.17
LIGHTBIT58  (via drill 0.51)
  Top 0.203: v110.49,11.43 111.12,12.06 111.12,20.95 110.49,21.59 110.49,22.86 SR3.16
  Bottom 0.203: SV1.18 v110.49,11.43
LIGHTBIT59
  Top 0.203: SV1.19 106.68,5.08 106.68,8.89 102.87,12.7 102.87,19.68 103.5,20.32 107.31,20.32 107.31,24.77 SR3.15
LIGHTBIT60
  Bottom 0.203: SV1.20 111.76,10.16 111.76,12.7 99.69,12.7 97.16,15.24 90.81,15.24 90.17,15.88 90.17,27.94 107.95,27.94 SR3.14
LIGHTBIT61  (via drill 0.51)
  Top 0.203: SV1.21 109.22,5.08 109.22,10.79 107.95,12.06 v107.95,17.78
  Bottom 0.203: v107.95,17.78 107.95,25.4 112.39,25.4 116.2,29.21 SR3.7
LIGHTBIT62
  Top 0.203: SV1.22 109.86,6.99 109.86,10.79 109.22,11.43 109.22,12.06 110.49,13.34 110.49,19.68 109.86,20.32 107.95,20.32 107.95,24.77 108.58,25.4 116.84,25.4 SR3.6
LIGHTBIT63  (via drill 0.51)
  Top 0.203: v113.67,15.24 114.3,15.88 114.3,21.59 SR3.5
  Bottom 0.203: SV1.23 114.3,5.08 114.3,15.24 v113.67,15.24
LIGHTBIT64
  Top 0.203: SV1.24 114.94,8.26 114.94,19.68 SR3.4
LIGHTBIT65
  Top 0.203: SV1.25 116.84,2.54 119.38,2.54 119.38,9.53 123.19,13.34 123.19,19.68 121.92,20.95 SR2.17
LIGHTBIT66
  Top 0.203: SV1.26 115.57,19.68 116.2,20.32 119.38,20.32 119.38,26.04 121.28,27.94 123.19,27.94 123.19,25.4 SR2.16
LIGHTBIT67
  Top 0.203: SV1.27 116.84,5.08 116.84,11.43 118.75,13.34 118.75,19.05 120.65,20.95 120.65,25.4 SR2.15
LIGHTBIT68  (via drill 0.51)
  Top 0.203: SV1.28 118.75,6.99 118.75,12.7 120.02,13.97 v120.02,16.51
  Bottom 0.203: v120.02,16.51 118.75,17.78 116.2,17.78 115.57,18.41 115.57,27.94 120.65,27.94 SR2.14
LIGHTBIT69
  Top 0.203: SV1.29 122.56,1.91 136.53,1.91 136.53,29.21 135.25,30.48 129.54,30.48 SR2.7
LIGHTBIT70
  Bottom 0.203: SV1.30 120.65,12.7 125.73,12.7 128.27,15.24 142.88,15.24 143.51,15.88 143.51,17.78 140.34,17.78 135.25,22.86 133.35,22.86 SR2.6
LIGHTBIT71  (via drill 0.51)
  Top 0.203: v127,12.06 128.27,13.34 128.27,22.86 SR2.5
  Bottom 0.203: SV1.31 124.46,5.08 124.46,12.06 v127,12.06
LIGHTBIT72  (via drill 0.51)
  Top 0.203: SV1.32 123.83,6.99 v123.83,20.32
  Bottom 0.203: v123.83,20.32 125.09,21.59 SR2.4
LIGHTBIT73
  Top 0.203: SV1.33 127,5.08 127,8.89 133.35,15.24 133.35,20.32 SR1.17
LIGHTBIT74
  Top 0.203: SV1.34 125.73,22.23 128.91,25.4 134.62,25.4 SR1.16
LIGHTBIT75
  Top 0.203: SV1.35 127,2.54 124.46,2.54 124.46,19.68 125.09,20.32 125.09,24.13 128.91,27.94 134.62,27.94 SR1.15
LIGHTBIT76
  Top 0.203: SV1.36 134.62,12.7 135.89,12.7 135.89,27.94 SR1.14
LIGHTBIT77
  Bottom 0.203: SV1.37 132.08,5.08 137.16,5.08 146.05,13.97 146.05,22.86 141.6,22.86 140.97,23.5 140.97,25.4 142.88,25.4 143.51,26.04 143.51,29.21 SR1.7
LIGHTBIT78
  Bottom 0.203: SV1.38 137.16,12.7 143.51,12.7 144.15,13.34 144.15,20.32 141.6,20.32 140.34,21.59 140.34,26.67 SR1.6
LIGHTBIT79
  Bottom 0.203: SV1.39 133.99,4.45 140.97,4.45 146.69,10.16 146.69,24.13 SR1.5
LIGHTBIT80
  Bottom 0.203: SV1.40 139.06,12.06 143.51,12.06 145.41,13.97 145.41,21.59 SR1.4
N$4
  Top 0.203: SR10.3 SR9.18
N$9
  Bottom 0.203: SR2.3 SR1.18
N$18
  Bottom 0.203: SR3.3 SR2.18
N$27
  Top 0.203: SR4.3 SR3.18
N$36
  Bottom 0.203: SR5.3 SR4.18
N$45
  Bottom 0.203: SR6.3 SR5.18
N$62
  Top 0.203: SR8.3 SR7.18
N$71
  Bottom 0.203: SR9.3 SR8.18
N$80
  Top 0.203: SR7.3 SR6.18
RCK
  Bottom 0.203: 95.25,35.56 85.09,35.56 SR5.12 82.55,35.56 62.23,35.56 | 95.25,35.56 SR4.12 | 107.95,35.56 SR3.12 | 95.25,35.56 107.95,35.56 | 120.65,35.56 SR2.12 | 107.95,35.56 120.65,35.56 | SR1.12 133.35,35.56 120.65,35.56 | VIN.8 6.35,34.29 SR10.12 13.97,35.56 24.13,35.56 | 24.13,35.56 SR9.12 | 36.83,35.56 SR8.12 | 24.13,35.56 36.83,35.56 | 49.53,35.56 SR7.12 | 36.83,35.56 49.53,35.56 | 62.23,35.56 SR6.12 | 49.53,35.56 62.23,35.56
SER_IN
  Bottom 0.203: VIN.6 3.81,19.05 3.81,38.1 136.53,38.1 141.6,33.02 142.88,33.02 143.51,32.38 143.51,30.48 141.6,30.48 139.7,28.57 139.7,19.05 SR1.3
SRCK
  Bottom 0.203: 95.25,30.48 85.09,30.48 SR5.13 82.55,30.48 62.23,30.48 | 95.25,30.48 SR4.13 | 107.95,30.48 SR3.13 | 95.25,30.48 107.95,30.48 | 120.65,30.48 SR2.13 | 107.95,30.48 120.65,30.48 | SR1.13 133.35,30.48 120.65,30.48 | VIN.7 11.43,24.13 11.43,30.48 | 11.43,30.48 11.43,31.75 SR10.13 | 24.13,30.48 SR9.13 | 11.43,30.48 24.13,30.48 | 36.83,30.48 SR8.13 | 24.13,30.48 36.83,30.48 | 49.53,30.48 SR7.13 | 36.83,30.48 49.53,30.48 | 62.23,30.48 SR6.13 | 49.53,30.48 62.23,30.48

### Text on the board
tPlace: ©2012 LipLabz | 80Bits Light register | LOWBITS | HIGHBITS